# EAGLE design GPS_Shield.v1 (EAGLE 7.5.0)
DATABASE: /home/monkbroc/Electronics/eagle/PARTSDB.tsv
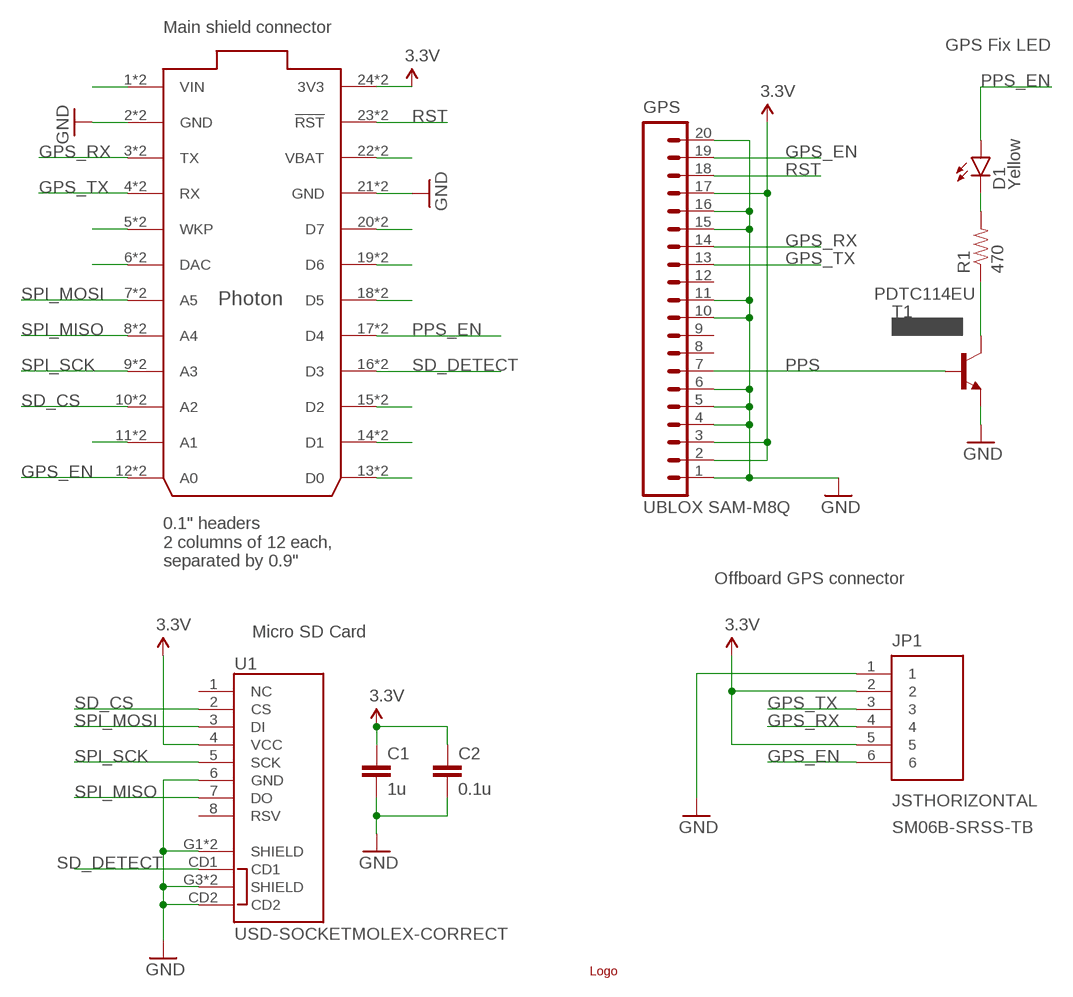
[diagram p0: schematic, sheet 1]

## Parts
C1  1u  CAP0603-CAP  [0603-CAP]
C2  0.1u  CAP0603-CAP  [0603-CAP]
CORE  PHOTONWITH_EXTERNAL_HEADERS  [PHOTON_STACKABLE_EXTERNAL]
D1  Yellow  LED-YELLOW0603  [LED-0603]
GPS  UBLOX SAM-M8Q  M20  [1X20]
JP1  JSTHORIZONTAL  [JST-6-SMD-HOR-1.0MM]
R1  470  RESISTOR0603-RES  [0603-RES]
T1  2N2222  [TO18]
U1  USD-SOCKETMOLEX-CORRECT  [MICRO-SD-MOLEX-CORRECT]
U$1  LOGO  [CARLOOP]

## Nets
3.3V: C1.1 C2.1 CORE.24(3V3) CORE.@24(3V3) GPS.2 GPS.3 GPS.17 JP1.2 JP1.5 U1.4(VCC)
CANA_EN: CORE.13(D0) CORE.@13(D0)
CANA_RX: CORE.15(D2) CORE.@15(D2)
CANA_TX: CORE.14(D1) CORE.@14(D1)
GND: C1.2 C2.2 CORE.2(GND) CORE.21(GND) CORE.@2(GND) CORE.@21(GND) GPS.1 GPS.4 GPS.5 GPS.6 GPS.10 GPS.11 GPS.15 GPS.16 GPS.20 JP1.1 T1.1(E) U1.6(GND) U1.CD2 U1.G1(SHIELD) U1.G2(SHIELD) U1.G3(SHIELD) U1.G4(SHIELD)
GPS_EN: CORE.12(A0) CORE.@12(A0) GPS.19 JP1.6
GPS_RX: CORE.3(TX) CORE.@3(TX) GPS.14 JP1.4
GPS_TX: CORE.4(RX) CORE.@4(RX) GPS.13 JP1.3
N$1: R1.1 T1.3(C)
N$7: D1.C R1.2
N$10: CORE.6(DAC) CORE.@6(DAC)
N$11: CORE.22(VBAT) CORE.@22(VBAT)
N$12: CORE.20(D7) CORE.@20(D7)
N$13: CORE.19(D6) CORE.@19(D6)
N$17: CORE.1(VIN) CORE.@1(VIN)
N$26: CORE.5(WKP) CORE.@5(WKP)
PPS: GPS.7 T1.2(B)
PPS_EN: CORE.17(D4) CORE.18(D5) CORE.@17(D4) CORE.@18(D5) D1.A
RST: CORE.23(!RST) CORE.@23(!RST) GPS.18
SD_CS: CORE.10(A2) CORE.@10(A2) U1.2(CS)
SD_DETECT: CORE.16(D3) CORE.@16(D3) U1.CD1
SPI_MISO: CORE.8(A4) CORE.@8(A4) U1.7(DO)
SPI_MOSI: CORE.7(A5) CORE.@7(A5) U1.3(DI)
SPI_SCK: CORE.9(A3) CORE.@9(A3) U1.5(SCK)
VBAT: CORE.11(A1) CORE.@11(A1)
Unconnected: GPS.8 GPS.9 GPS.12 U1.1(NC) U1.8(RSV)

## Notes on the sheet
- Main shield connector
- GPS Fix LED
- PDTC114EU
- 0.1" headers
  2 columns of 12 each,
  separated by 0.9"
- Offboard GPS connector
- Micro SD Card
- SM06B-SRSS-TB

## Library data of the parts
C1 C2 = SparkFun-Passives:CAP: Capacitor Standard 0603 ceramic capacitor, and 0.1" leaded capacitor.
CORE = MuniRent:PHOTON; BOM: EXCLUDE; PARTNO: *
D1 = SparkFun-LED:LED-YELLOW: Yellow SMD LEDs LilyPad 1206- DIO-09909 0603- DIO-09003 "SMART" means more efficient and expensive; PROD_ID: DIO-09003
GPS = SparkFun-Connectors:M20: 1x20 .1" header This is just like the LOCK variant in that the holes are staggared by 5 mil, but except for the last two holes. They are not altered from the "standard" footprint layout. This is used for a special purpose on the layout of our Graphic LCD Backpack. Make sure you want to use this device before selecting it for you project!
JP1 = MuniRent:JST; PARTNO: SM06B-SRSS-TB
R1 = SparkFun-Passives:RESISTOR: Resistor Basic schematic elements and footprints for 0603, 1206, and PTH resistors.
T1 = transistor:2N2222: NPN TRANSISTOR
U1 = MuniRent:USD-SOCKET: microSD Socket Push-push type uSD socket. Schematic element and footprint production proven. Spark Fun Electronics SKU : PRT-00127. tDoc lines correctly indicate media card edge positions when inserting (unlocked, locked, depressed). NOTE: CD1 and CD2 are connected internally
U$1 = MuniRent:LOGO

## Net classes
0 default: width 0.254 mm
1 power: width 0.813 mm, clearance 0.406 mm

## Board
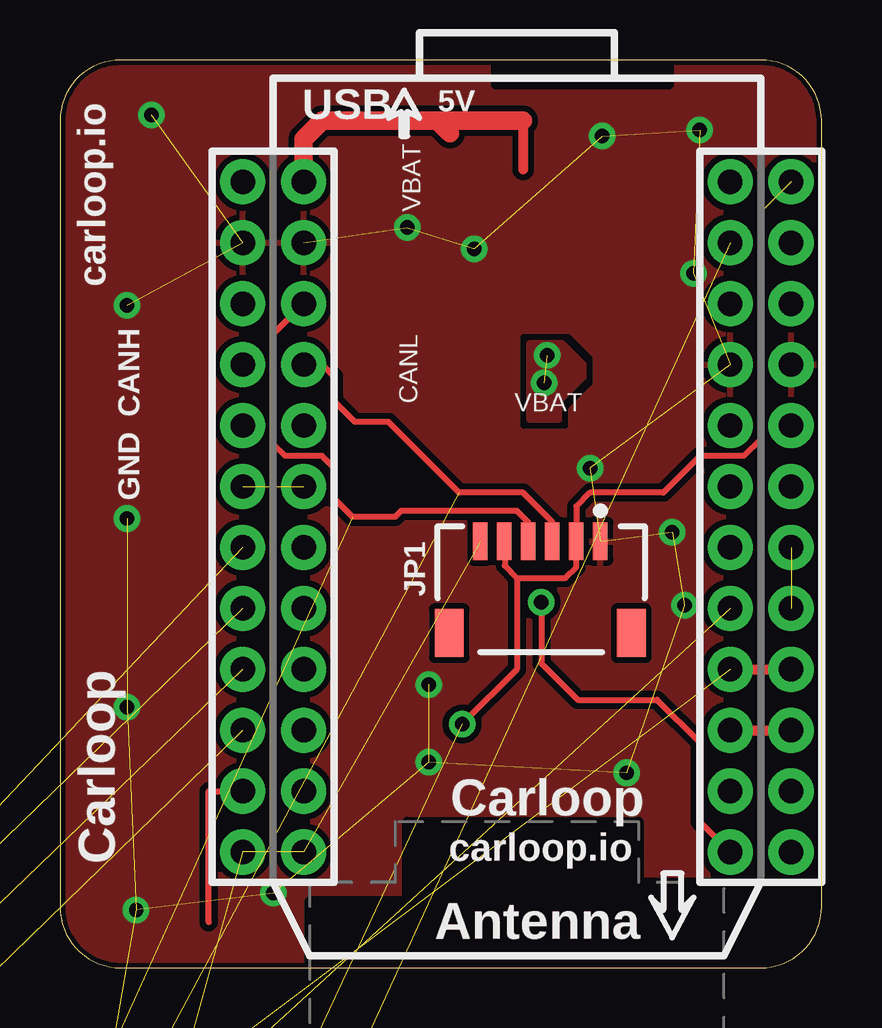
[diagram p1: board, top side]
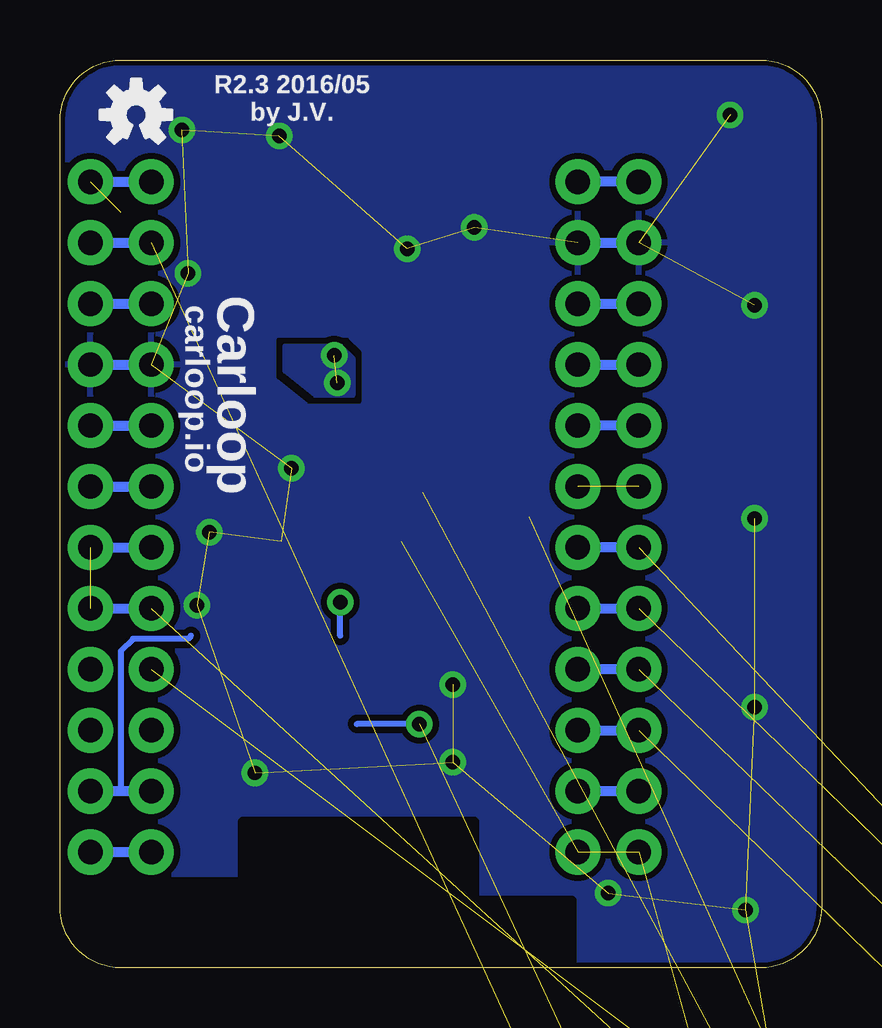
[diagram p2: board, bottom side, seen from below]

Size 31.75 x 37.85 mm. Coordinates in mm from the lower left corner, seen from the top.
Outline: 29.21,37.85 2.54,37.85 arc90 0,35.31 0,2.54 arc90 2.54,0 29.21,0 arc90 31.75,2.54 31.75,35.31 arc90 29.21,37.85
Copper layers (1*16): Top 0.035mm / dielectric 1.5mm / Bottom 0.035mm
Design rules "SparkFun *": minimum track width 8mil, minimum drill 20mil, track to track 10mil, track to pad 8mil, pad to pad 10mil, via to via 10mil, smd to smd 10mil, copper to edge 8mil, drill to drill 8mil, minimum pad ring 12mil, minimum via ring 10mil, stop-mask expansion 4mil, vias tented up to drill 25mil, thermal gap 10mil
tRestrict: area 10.4,-3 to 27.4,6.1; area 18.2,36.8 to 25.4,38
bRestrict: area 10.4,-3 to 27.4,6.1

### Footprints (pad centres in the part's own frame; a part is rotated, then mirrored left to right if it is on the bottom)
0603-CAP = smd 1.1 x 1: 1 -0.85,0; 2 0.85,0
PHOTON_STACKABLE_EXTERNAL = drill 1.016 pad 1.88: 1 1.27,32.258; 2 1.27,29.718; 3 1.27,27.178; 4 1.27,24.638; 5 1.27,22.098; 6 1.27,19.558; 7 1.27,17.018; 8 1.27,14.478; 9 1.27,11.938; 10 1.27,9.398; 11 1.27,6.858; 12 1.27,4.318; 13 19.05,4.318; 14 19.05,6.858; 15 19.05,9.398; 16 19.05,11.938; 17 19.05,14.478; 18 19.05,17.018; 19 19.05,19.558; 20 19.05,22.098; 21 19.05,24.638; 22 19.05,27.178; 23 19.05,29.718; 24 19.05,32.258; @1 -1.27,32.258; @2 -1.27,29.718; @3 -1.27,27.178; @4 -1.27,24.638; @5 -1.27,22.098; @6 -1.27,19.558; @7 -1.27,17.018; @8 -1.27,14.478; @9 -1.27,11.938; @10 -1.27,9.398; @11 -1.27,6.858; @12 -1.27,4.318; @13 21.59,4.318; @14 21.59,6.858; @15 21.59,9.398; @16 21.59,11.938; @17 21.59,14.478; @18 21.59,17.018; @19 21.59,19.558; @20 21.59,22.098; @21 21.59,24.638; @22 21.59,27.178; @23 21.59,29.718; @24 21.59,32.258
LED-0603 = smd 1 x 1: A 0,-0.877; C 0,0.877
1X20 = drill 1.016 pad 1.88 square: 1 0,0 | drill 1.016 pad 1.88: 2 2.54,0; 3 5.08,0; 4 7.62,0; 5 10.16,0; 6 12.7,0; 7 15.24,0; 8 17.78,0; 9 20.32,0; 10 22.86,0; 11 25.4,0; 12 27.94,0; 13 30.48,0; 14 33.02,0; 15 35.56,0; 16 38.1,0; 17 40.64,0; 18 43.18,0; 19 45.72,0; 20 48.26,0
JST-6-SMD-HOR-1.0MM = smd 0.6 x 1.55: 1 2.46,1.27; 2 1.46,1.27; 3 0.46,1.27; 4 -0.54,1.27; 5 -1.54,1.27; 6 -2.54,1.27 | smd 1.2 x 2: P$1 -3.84,-2.555; P$2 3.76,-2.555
0603-RES = smd 1.1 x 1: 1 -0.85,0; 2 0.85,0
TO18 = drill 0.813 octagon: 1 -1.27,-1.27; 2 1.27,-1.27; 3 1.27,1.27
MICRO-SD-MOLEX-CORRECT = smd 0.85 x 1.1: 1 3.105,0.25; 2 2.005,0.25; 3 0.905,0.25; 4 -0.195,0.25; 5 -1.295,0.25; 6 -2.395,0.25; 7 -3.495,0.25 | smd 0.75 x 1.1: 8 -4.545,0.25 | smd 1.2 x 1: CD1 5.74,6.4; CD2 5.74,10.1 | smd 1.55 x 1.35: G1 5.565,0.375 | smd 1.17 x 1.8: G2 -5.755,0.6 | smd 1.9 x 1.35: G3 -3.735,11.075; G4 2.235,11.075

### Placement (x,y rotation side)
C1  -69.34,-70.87 0 top  (outside the outline)
C2  -69.34,-73.41 0 top  (outside the outline)
CORE  8.89,0.51 0 top
D1  -59.05,-63.63 0 top  (outside the outline)
F2  [OSHW-LOGO-S]  28.57,35.56 0 bottom
GPS  -55.5,-57.79 0 top  (outside the outline)
JP1  20.07,16.51 0 top
R1  -58.67,-66.55 0 top  (outside the outline)
T1  -53.34,-62.23 0 top  (outside the outline)
U1  -66.8,-60.71 0 top  (outside the outline)
U$1  42.42,5.33 0 top  (outside the outline)
ZDRAW1  [A4L-LOC]  -56.39,-53.21 0 top  (outside the outline)

### Tracks (layer width: path | path; a pad name or v marks a point on that pad's centre or on a via)
3.3V  (via drill 0.6)  (7 unrouted)
  Top 0.254: 29.21,31.5 29.21,22.05 28.5,21.34 26.67,21.34 25.15,19.81 22.1,19.81 21.53,19.24 JP1.2 21.53,16.7 21.08,16.26 19.05,16.26 | JP1.5 18.54,17.76 18.54,16.76 19.05,16.26 | 19.05,16.26 19.05,12.45 v16.76,10.16
  Bottom 0.254: v16.76,10.16 19.37,10.16
  Bottom 0.406: CORE.@24 CORE.24
+12V  (via drill 0.6)  (1 unrouted)
  other vias: 20.32,25.53 20.19,24.38
  pour Bottom (no thermals): 19.56,23.88 21.08,23.88 22.35,24.89 22.35,25.91 20.07,25.91 19.56,25.4
  pour Top: 19.56,26.04 19.56,22.86 20.83,22.86 20.83,23.62 21.84,24.64 21.84,25.15 20.95,26.04
CANA_EN  (via drill 0.6)
  Top 0.254: v20.07,15.24 20.07,12.7 21.59,11.18 24.89,11.18 26.67,9.4 26.67,6.1 CORE.13
  Bottom 0.254: 20.07,13.84 v20.07,15.24
  Bottom 0.406: CORE.@13 CORE.13
CANA_RX
  Top 0.406: CORE.15 CORE.@15
  Bottom 0.254: 27.81,10.03 CORE.15
CANA_TX
  Bottom 0.254: 26.29,13.84 26.42,13.72 28.7,13.72 29.21,13.21 29.21,7.37
  Bottom 0.406: CORE.14 29.21,7.37 CORE.@14
GND  (via drill 0.6)  (37 unrouted)
  Bottom 0.406: CORE.@21 CORE.21 | CORE.2 CORE.@2
  other vias: 2.79,27.62 2.79,18.73 2.79,10.86 3.81,35.56 3.17,2.41 25.53,18.16 23.62,8.13 22.1,20.83 8.89,3.11 15.37,8.57 26.04,15.11 14.48,30.86 22.61,34.67 26.67,34.92 17.27,29.97 15.37,11.81 26.42,28.96
  pour Top (rank 4): 29.21,37.85 2.54,37.85 arc90 0,35.31 0,2.54 arc90 2.54,0 29.21,0 arc90 31.75,2.54 31.75,35.31 arc90
  pour Bottom (rank 4): 29.21,37.85 2.54,37.85 arc90 0,35.31 0,2.54 arc90 2.54,0 29.21,0 arc90 31.75,2.54 31.75,35.31 arc90
GPS_EN  (3 unrouted)
GPS_RX  (1 unrouted)
  Top 0.254: JP1.4 19.53,18.57 19.05,19.05 14.22,19.05 13.97,18.8 12.19,18.8 11.43,19.56 11.43,20.83 10.92,21.34 9.4,21.34 8.89,21.84 8.89,26.42 CORE.3
  Bottom 0.406: CORE.3 CORE.@3
GPS_TX  (1 unrouted)
  Top 0.254: JP1.3 20.53,18.59 19.3,19.81 16.64,19.81 13.69,22.76 12.29,22.76 11.43,23.62 11.43,24.64 10.92,25.15 CORE.4
  Bottom 0.406: CORE.4 CORE.@4
N$1  (1 unrouted)
N$7  (1 unrouted)
N$10  (1 unrouted)
N$11
  Bottom 0.406: CORE.@22 CORE.22
N$12
  Bottom 0.406: CORE.@20 CORE.20
N$13
  Bottom 0.406: CORE.@19 CORE.19
N$17
  Top 0.406: 19.3,35.31 19.3,33.27 | 16.51,35.31 16.26,35.05
  Top 0.762: CORE.1 10.16,34.54 10.92,35.31 15.75,35.31 | 15.75,35.31 16.26,35.31 | 16.26,35.31 16.51,35.31 19.3,35.31 | 16.26,35.05 16.26,35.31 | 16.26,35.31 16,35.05 | 16.26,34.8 15.75,35.31
  Bottom 0.406: CORE.@1 CORE.1
N$26
  Bottom 0.406: CORE.@5 CORE.5
PPS  (1 unrouted)
PPS_EN  (2 unrouted)
  Bottom 0.406: CORE.@18 CORE.18 | CORE.@17 CORE.17
RST  (1 unrouted)
  Bottom 0.406: CORE.@23 CORE.23
SD_CS  (1 unrouted)
  Bottom 0.406: CORE.10 CORE.@10
SD_DETECT  (1 unrouted)
  Top 0.406: CORE.16 CORE.@16
SPI_MISO  (1 unrouted)
  Bottom 0.406: CORE.8 CORE.@8
SPI_MOSI  (1 unrouted)
  Bottom 0.406: CORE.@7 CORE.7
SPI_SCK  (1 unrouted)
  Bottom 0.406: CORE.@9 CORE.9
VBAT
  Top 0.254: CORE.@11 6.21,7.37 6.21,1.91
  Bottom 0.406: CORE.@11 CORE.11

### Text on the board
tPlace: USB | 5V | carloop.io | VBAT | CANH | CANL | VBAT | GND | DO NOT USE / THIS LAYOUT | Carloop | Carloop | carloop.io | Carloop / GPS | Antenna | carloop.io
bPlace: R2.3 2016/05 / by J.V. | Carloop | carloop.io
Document: NOTES: | Revision 2.3 | Julien Vanier | jvanier@gmail.com
Reference: OBD | connected car kit | Make / apps / for / your / car | 12V | PARTICLE | powered | G / P / S | Make apps / for your | MAKE APPS / FOR YOUR / CAR | MAKE / APPS / FOR / YOUR / CAR | CAR | Make apps / for your car